# Altium schematic sheet BSPD_SCH.SchDoc: BSPD
size A4; CompanyName: CURT; DrawnBy: Ali Badry; Engineer: Ali Badry; Revision: V0; SheetNumber: 1; SheetTotal: 1
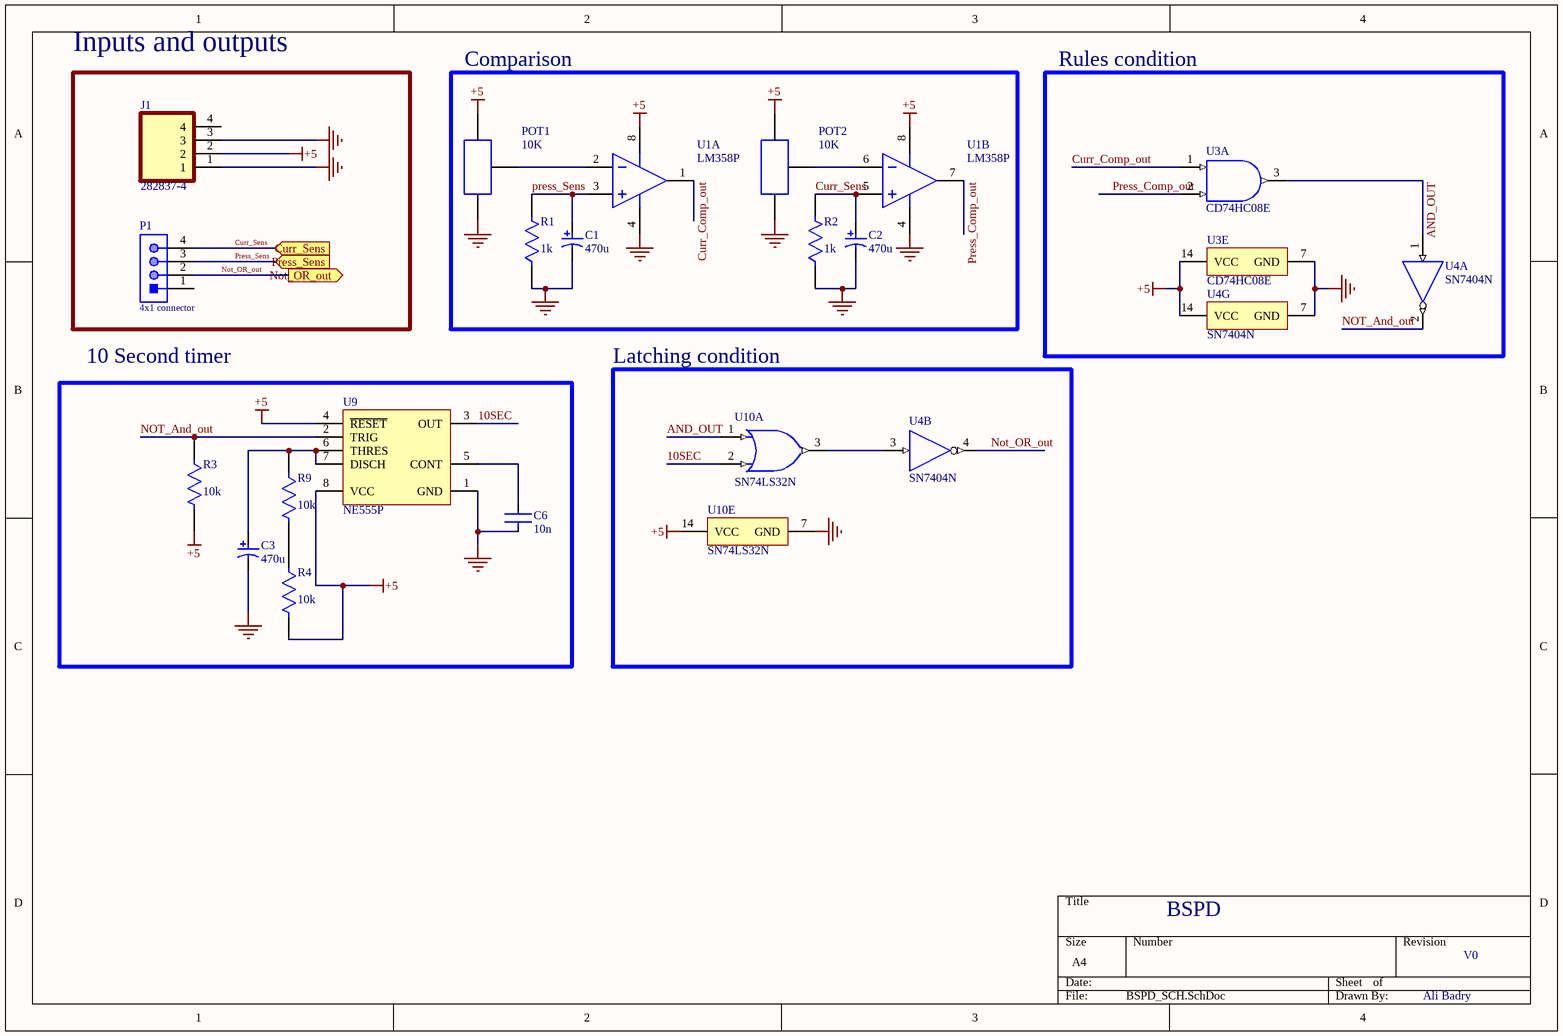
[diagram p0: BSPD_SCH.SchDoc]

## Parts
C1  470u  [NIC-UVR-10x12.5-2_V]
C2  470u  [NIC-UVR-10x12.5-2_V]
C3  470u  [NIC-UVR-10x12.5-2_V]
C6  10n  [FP-RCE0K1-MFG]
J1  282837-4  [TE_282837-4]
P1  4x1 connector  [64900411122]
POT1  10K  [POT_trimmer]
POT2  10K  [POT_trimmer]
R1  value 1k  [FP-MFR-25-MFG]  (hidden comment: CMP-03413-000001-1)
R2  value 1k  [FP-MFR-25-MFG]  (hidden comment: CMP-03413-000001-1)
R3  value 10k  [FP-MFR-25-MFG]  (hidden comment: CMP-03413-000001-1)
R4  value 10k  [FP-MFR-25-MFG]  (hidden comment: CMP-03413-000001-1)
R9  value 10k  [FP-MFR-25-MFG]  (hidden comment: CMP-03413-000001-1)
U1  LM358P  [P0008A]  (parts A,B of 2)
U3  CD74HC08E  [N0014A]  (parts A,E of 5)
U4  SN7404N  [N0014A]  (parts A,B,G of 7)
U9  NE555P  [P0008A]
U10  SN74LS32N  [N0014A]  (parts A,E of 5)

## Blocks framed on the sheet
Inputs and outputs: J1 P1
Comparison: C1 C2 POT1 POT2 R1 R2 U1
Rules condition: U3 U4
10 Second timer: C3 C6 R3 R4 R9 U9
Latching condition: U4 U10

## Ports
Curr_Sens (in), Not_OR_out (out), Press_Sens (in)

## Nets
+5: J1.2 POT1.1 POT2.1 R3.2 R4.2 U1.8(VCC) U3.14(VCC) U4.14(VCC) U9.4(~{RESET}) U9.8(VCC) U10.14(VCC)
GND: C1.2 C2.2 C3.2 C6.1 J1.1 J1.3 POT1.3 POT2.3 R1.1 R2.1 U1.4(GND) U3.7(GND) U4.7(GND) U9.1(GND) U10.7(GND)
10SEC: U9.3(OUT) U10.2(1B)
AND_OUT: U3.3(1Y) U4.1(1A) U10.1(1A)
Curr_Comp_out: U1.1(1OUT) U3.1(1A)
Curr_Sens: C2.1 P1.4 R2.2 U1.5(2IN+) ; port Curr_Sens
NOT_And_out: R3.1 U4.2(~{1Y}) U9.2(TRIG)
Not_OR_out: P1.2 U4.4(~{2Y}) ; port Not_OR_out
Press_Comp_out: U1.7(2OUT) U3.2(1B)
Press_Sens: C1.1 P1.3 R1.2 U1.3(1IN+) ; port Press_Sens
NetC3_1: C3.1 R9.1 U9.6(THRES) U9.7(DISCH)
NetC6_2: C6.2 U9.5(CONT)
NetPOT1_2: POT1.2 U1.2(1IN-)
NetPOT2_2: POT2.2 U1.6(2IN-)
NetR4_1: R4.1 R9.2
NetU4_3: U4.3(2A) U10.3(1Y)

Not connected (* = marked no-connect by the designer): J1 4; P1 1

## Library data of the parts
C1-C3 = CMP-1217-00001-1: Aluminum Electrolytic Capacitor, 63 V, -40 to 85 degC, 2-Pin CAP, RoHS; Manufacturer: Nichicon; PartNumber: UVR1J101MPD1TD; Capacitance Tolerance: +/-20%; Rated Voltage: 63 V; Packing: Bulk; Rated Ripple@85 degC 120 Hz: 300 mA; Rated Capacitance: 100 uF; ComponentLink3URL: http://nichicon-us.com/english/products/pdfs/e-vr.pdf; ComponentLink2Description: Datasheet; Operating Temperature: -40 to 85 degC; PackageDescription: 2-Pin Through Hole Package, Dia 10 mm, Body Length 12.5 mm, Pitch 5 mm; Mounting Technology: Through Hole; ComponentLink3Description: Package Specification; RoHS: TRUE; DatasheetVersion: Sep-13; ComponentLink1Description: Manufacturer URL; ComponentLink2URL: http://nichicon-us.com/english/products/pdfs/e-vr.pdf; ComponentLink1URL: http://www.nichicon.co.jp/
C6 = CMP-06035-031680-1: Cap Ceramic 1nF 50V C0G ±5% Radial 5mm +125°C Automotive Bulk; Lead Diameter: 0.5mm; Lead/Base Style: Formed Leads; Tolerance: 5%; Min Operating Temperature: -55°C; Max Operating Temperature: 125°C; Voltage Rating: 50V; Lead Pitch: 0.197inch; Package Quantity: 2000; Resistor Type: Ceramic; Length: 0.142inch; Ratings: AEC-Q200; Voltage Rating (DC): 50V; Packaging: Tape and Reel; Height - Seated (Max): 0.138inch; Width: 0.098inch; Case/Package: Radial; Capacitance: 1nF; Mount: Through Hole; Dielectric: C0G; Termination: Radial; Height: 3.5mm
J1 = 282837-4: 4 Position Wire to Board Terminal Block Horizontal with Board 0.200 (5.08mm); MF: TE Connectivity; Check_prices: https://www.snapeda.com/parts/282837-4/TE%20Connectivity%20AMP%20Connectors/view-part/520354/?ref=eda; Purchase-URL: https://pricing.snapeda.com/search/part/282837-4/?ref=eda; Value: *; SnapEDA_Link: https://www.snapeda.com/parts/282837-4/TE%20Connectivity%20AMP%20Connectors/view-part/520354/?ref=snap; EU_RoHS_Compliance: Compliant with Exemptions; Package: None; Availability: Good; Price: None; MP: 282837-4
P1 = CMP-1502-00554-1: THT Male Header WR-MPC4, Vertical, Single Row, pitch 4.2 mm, 4 pins; Manufacturer: Wurth Elektronik; Pitch: 4.2mm; Working Voltage: 600VAC; Contact Resistance: 10mOhm; Pin Number: 4; Part Number: 64900411122; Orientation: Vertical; Gender: Male; Operating Temperature: -40to105degC; Package Reference: 64900411122; Mounting Technology: THT; Datasheet URL: https://katalog.we-online.de/em/datasheet/6490xx11122.pdf; Manufacturer URL: http://www.we-online.de; Publisher: WurthElektronik; Packaging: Tray
POT1 POT2 = Potentiometer: Trimmer, 10K, 0.25W, 1TURN; Manufacturer: Piher; Manufacturer Part Number: PT15NV15-103A2020-S; Supplier 1: Digi-Key; Supplier Part Number 1: 1993-1201-ND; RoHS: No; Stock 1: 9914; Pricing 1: 1=0.85000, 10=0.76200, 25=0.68840, 50=0.66380, 100=0.62690, 250=0.60236, 500=0.56548, 1000=0.46713, 5000=0.38108 (USD)
R1-R4 R9 = CMP-03413-000001-1: RES 1.18K OHM 1/4W 1% AXIAL; Manufacturer: Yageo; Manufacturer Part Number: MFR-25FBF52-1K18; Temperature Coefficient: 100ppm/°C; Power Rating: 0.25W; Voltage Rating: 250V; Resistance: R; Temperature: -55°C to +155°C; Automotive: No; Temperature Range High: +155°C; Mouser Description: Metal Film Resistors 1.18K OHM 1/4W 1%; Digikey Description: RES 1.18K OHM 1/4W 1% AXIAL; Lead Free: Yes; Tolerance: 1%; ComponentLink2Description: Datasheet; ComponentLink2URL: https://www.yageo.com/upload/media/product/products/datasheet/lr/Yageo_LR_MFR_1.pdf; Temperature Range Low: -55°C; Package: MFR-25; Ipc Land Pattern Name: RESAD1000W75L680D260; Composition: Metal Film; Category: Res; Octopart: https://octopart.com/mfr-25fbf52-1k18-yageo-56251681; Series: MFR; Device Class L2: Resistors; Height: 2.6mm; Device Class L3: Through-Hole Resistors; RoHS: TRUE; Device Class L1: Passive Components
U1 = CMP-2000-06549-1: Dual Operational Amplifier, 3 to 32 V, 0 to 70 degC, 8-Pin PDIP (P), RoHS, Tape and Reel; Manufacturer: Technik Industrial; Datasheet Version: Rev. T, 04/2015; Datasheet URL: http://www.ti.com/lit/ds/symlink/lm358.pdf; Manufacturer URL: http://www.technik.com.hk/; Package Description: 8-Pin Double In-line Package, Body 9.59 x 6.35 mm, Pitch 2.54 mm; Mounting Technology: ThroughHole; Package URL: http://www.ti.com/lit/ml/mpdi001b/mpdi001b.pdf; Package Reference: P8
U3 = CMP-0777-00277-3: High Speed CMOS Logic Quad 2-Input AND Gates, N0014A, TUBE; Manufacturer: Texas Instruments; Bits(#): 4; Voltage(Nom)(V): 5; VCC(Max)(V): 6; Schmitt Trigger: No; tpd @ Nom Voltage(Max)(ns): 23; Rating: Catalog; VCC(Min)(V): 2; F @ Nom Voltage(Max)(Mhz): 70; Technology Family: HC; Output Drive (IOL/IOH)(Max)(mA): -24/24; ICC @ Nom Voltage(Max)(mA): 0.02; Operating Temperature Range(C): -55 to 125; PackageReference: N0014A; Input Type: CMOS; Generic Part Number: CD74HC08; Output Type: CMOS; DatasheetVersion: SCHS118C
U4 = CMP-1615-00872-2: Hex inverters, N0014A, TUBE; Generic Part Number: SN7404; Manufacturer: Texas Instruments; Voltage(Nom)(V): 5; Bits(#): 6; tpd @ Nom Voltage(Max)(ns): 22; Schmitt Trigger: No; VCC(Max)(V): 5.25; ICC @ Nom Voltage(Max)(mA): 0.033; Technology Family: TTL; Rating: Catalog; F @ Nom Voltage(Max)(Mhz): 35; Output Type: CMOS; VCC(Min)(V): 4.75; Output Drive (IOL/IOH)(Max)(mA): -0.4/16; DatasheetVersion: SDLS029C; Code_JEDEC: MS-001; Operating Temperature Range(C): 0 to 70; PackageReference: N0014A; Input Type: TTL
U9 = CMP-2000-04954-1: Precision Timer, 4.5 to 16 V, 0 to 70 degC, 8-Pin DIP, Pb-Free, Tube; Manufacturer: TexasInstruments; Maximum High Level Output Current: -200mA; Number of Internal Timers: 1; Operating Supply Voltage: 5|9|12|15V; Maximum Low Level Output Current: 200mA; Rad Hard: No; Packaging: Rail/Tube; Manufacturer URL: http://www.ti.com/; Package Reference: P8; Package Description: 8-Pin Double In-line Package, Body 9.59 x 6.35 mm, Pitch 2.54 mm; Package URL: http://www.ti.com/lit/ml/mpdi001b/mpdi001b.pdf; Type: Standard; Datasheet URL: http://www.ti.com/general/docs/lit/getliterature.tsp?genericPartNumber=NE555&fileType=pdf; Category: Timer; Package: 8PDIP; Datasheet Version: Rev. I, 09/2014
U10 = CMP-1573-00145-3: Quad 2-input positive-OR gates, N0014A, TUBE; Manufacturer: Texas Instruments; tpd @ Nom Voltage(Max)(ns): 22; Output Drive (IOL/IOH)(Max)(mA): 0.8/-16; Input Type: TTL; VCC(Min)(V): 4.75; F @ Nom Voltage(Max)(Mhz): 35; Voltage(Nom)(V): 5; ICC @ Nom Voltage(Max)(mA): 0.038; VCC(Max)(V): 5.25; Rating: Catalog; Bits(#): 4; Generic Part Number: SN74LS32; DatasheetVersion: SDLS100; Operating Temperature Range(C): 0 to 70; Output Type: TTL; Code_JEDEC: MS-001; PackageVersion: http://www.ti.com/lit/ml/mpdi002c/mpdi002c.pdf; PackageReference: N0014A